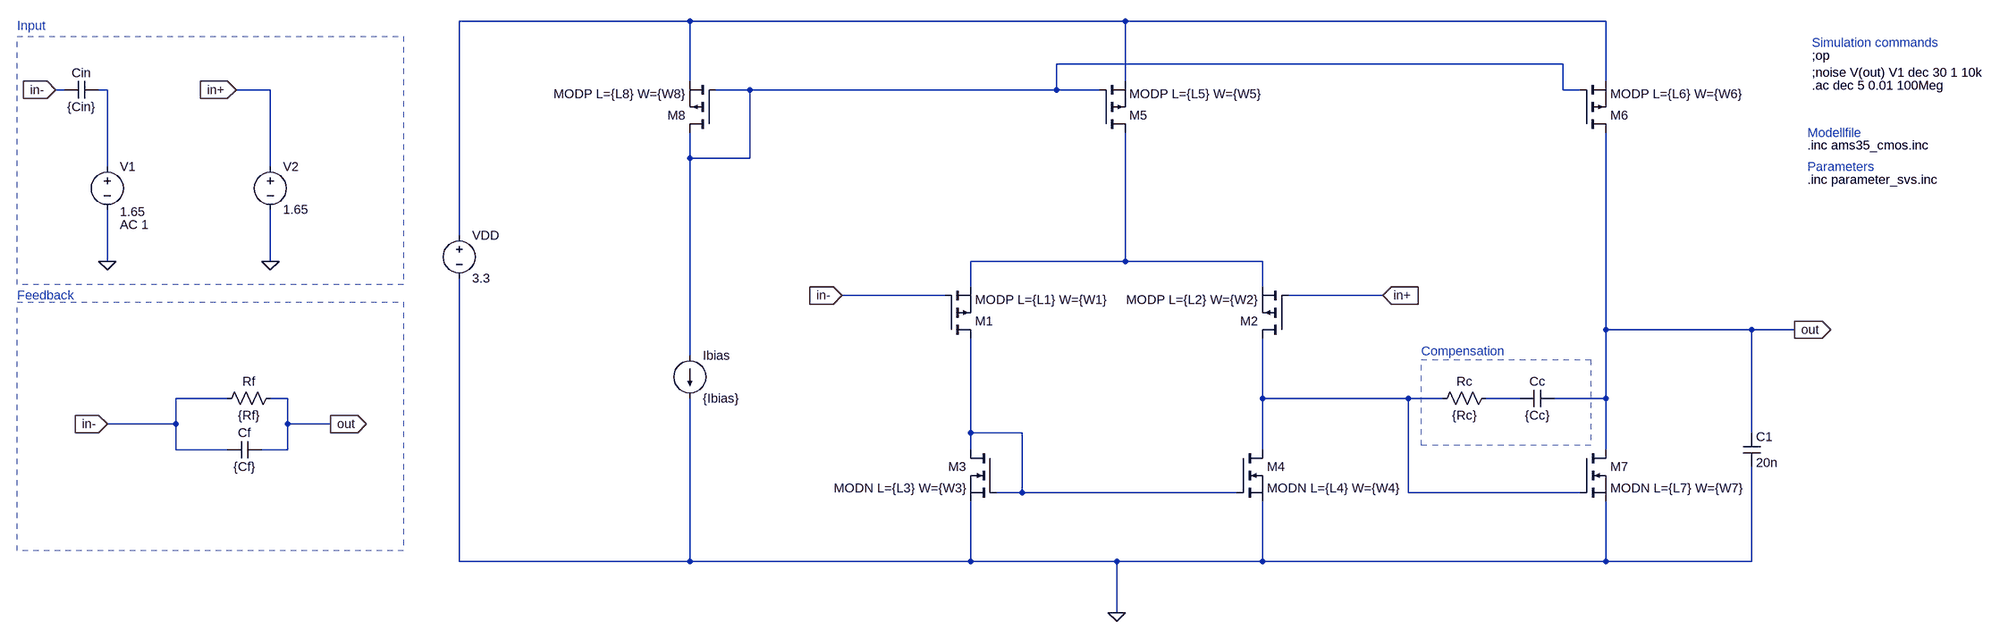
[diagram p0: schematic miller_ota_svs.asc]
miller_ota_svs.asc, the LTspice schematic file:
Version 4
SHEET 1 4076 2488
WIRE 1296 816 816 816
WIRE 2176 816 1296 816
WIRE 3072 816 2176 816
WIRE 2992 896 2048 896
WIRE 1296 928 1296 816
WIRE 2176 928 2176 816
WIRE 3072 928 3072 816
WIRE 80 944 64 944
WIRE 160 944 144 944
WIRE 464 944 400 944
WIRE 1408 944 1344 944
WIRE 2048 944 2048 896
WIRE 2048 944 1408 944
WIRE 2128 944 2048 944
WIRE 2992 944 2992 896
WIRE 3024 944 2992 944
WIRE 1296 1072 1296 1024
WIRE 1408 1072 1408 944
WIRE 1408 1072 1296 1072
WIRE 160 1088 160 944
WIRE 464 1088 464 944
WIRE 816 1216 816 816
WIRE 160 1264 160 1168
WIRE 464 1264 464 1168
WIRE 2176 1264 2176 1024
WIRE 2176 1264 1888 1264
WIRE 2432 1264 2176 1264
WIRE 1888 1312 1888 1264
WIRE 2432 1312 2432 1264
WIRE 1840 1328 1648 1328
WIRE 2656 1328 2480 1328
WIRE 3072 1392 3072 1024
WIRE 3344 1392 3072 1392
WIRE 3424 1392 3344 1392
WIRE 1296 1440 1296 1072
WIRE 384 1520 288 1520
WIRE 496 1520 464 1520
WIRE 2432 1520 2432 1408
WIRE 2704 1520 2432 1520
WIRE 2768 1520 2704 1520
WIRE 2912 1520 2848 1520
WIRE 3072 1520 3072 1392
WIRE 3072 1520 2976 1520
WIRE 288 1568 288 1520
WIRE 288 1568 160 1568
WIRE 496 1568 496 1520
WIRE 576 1568 496 1568
WIRE 1888 1584 1888 1408
WIRE 1984 1584 1888 1584
WIRE 3344 1584 3344 1392
WIRE 288 1616 288 1568
WIRE 384 1616 288 1616
WIRE 496 1616 496 1568
WIRE 496 1616 448 1616
WIRE 1888 1616 1888 1584
WIRE 2432 1616 2432 1520
WIRE 3072 1616 3072 1520
WIRE 1984 1696 1984 1584
WIRE 1984 1696 1936 1696
WIRE 2384 1696 1984 1696
WIRE 2704 1696 2704 1520
WIRE 3024 1696 2704 1696
WIRE 816 1824 816 1296
WIRE 1296 1824 1296 1520
WIRE 1296 1824 816 1824
WIRE 1888 1824 1888 1712
WIRE 1888 1824 1296 1824
WIRE 2160 1824 1888 1824
WIRE 2432 1824 2432 1712
WIRE 2432 1824 2160 1824
WIRE 3072 1824 3072 1712
WIRE 3072 1824 2432 1824
WIRE 3344 1824 3344 1648
WIRE 3344 1824 3072 1824
WIRE 2160 1920 2160 1824
FLAG 3424 1392 out
IOPIN 3424 1392 Out
FLAG 2656 1328 in+
IOPIN 2656 1328 In
FLAG 1648 1328 in-
IOPIN 1648 1328 In
FLAG 2160 1920 0
FLAG 64 944 in-
IOPIN 64 944 In
FLAG 400 944 in+
IOPIN 400 944 In
FLAG 160 1264 0
FLAG 464 1264 0
FLAG 576 1568 out
IOPIN 576 1568 Out
FLAG 160 1568 in-
IOPIN 160 1568 In
SYMBOL pmos 1840 1408 M180
SYMATTR InstName M1
SYMATTR Value MODP L={L1} W={W1}
SYMBOL pmos 2480 1408 R180
SYMATTR InstName M2
SYMATTR Value MODP L={L2} W={W2}
SYMBOL pmos 2128 1024 M180
SYMATTR InstName M5
SYMATTR Value MODP L={L5} W={W5}
SYMBOL nmos 2384 1616 R0
SYMATTR InstName M4
SYMATTR Value MODN L={L4} W={W4}
SYMBOL nmos 1936 1616 M0
SYMATTR InstName M3
SYMATTR Value MODN L={L3} W={W3}
SYMBOL voltage 816 1200 R0
WINDOW 123 0 0 Left 2
WINDOW 39 0 0 Left 2
SYMATTR InstName VDD
SYMATTR Value 3.3
SYMBOL nmos 3024 1616 R0
SYMATTR InstName M7
SYMATTR Value MODN L={L7} W={W7}
SYMBOL pmos 3024 1024 M180
SYMATTR InstName M6
SYMATTR Value MODP L={L6} W={W6}
SYMBOL pmos 1344 1024 R180
SYMATTR InstName M8
SYMATTR Value MODP L={L8} W={W8}
SYMBOL current 1296 1440 R0
WINDOW 123 0 0 Left 2
WINDOW 39 0 0 Left 2
SYMATTR InstName Ibias
SYMATTR Value {Ibias}
SYMBOL cap 3328 1584 R0
SYMATTR InstName C1
SYMATTR Value 20n
SYMBOL cap 2976 1504 R90
WINDOW 0 0 32 VBottom 2
WINDOW 3 32 32 VTop 2
SYMATTR InstName Cc
SYMATTR Value {Cc}
SYMBOL res 480 1504 R90
WINDOW 0 0 56 VBottom 2
WINDOW 3 32 56 VTop 2
SYMATTR InstName Rf
SYMATTR Value {Rf}
SYMBOL cap 448 1600 R90
WINDOW 0 0 32 VBottom 2
WINDOW 3 32 32 VTop 2
SYMATTR InstName Cf
SYMATTR Value {Cf}
SYMBOL voltage 160 1072 R0
WINDOW 123 24 124 Left 2
WINDOW 39 0 0 Left 0
WINDOW 3 24 100 Left 2
SYMATTR Value2 AC 1
SYMATTR Value 1.65
SYMATTR InstName V1
SYMBOL voltage 464 1072 R0
WINDOW 123 0 0 Left 0
WINDOW 39 0 0 Left 0
SYMATTR InstName V2
SYMATTR Value 1.65
SYMBOL cap 144 928 R90
WINDOW 0 0 32 VBottom 2
WINDOW 3 32 32 VTop 2
SYMATTR InstName Cin
SYMATTR Value {Cin}
SYMBOL res 2864 1504 R90
WINDOW 0 0 56 VBottom 2
WINDOW 3 32 56 VTop 2
SYMATTR InstName Rc
SYMATTR Value {Rc}
TEXT 3448 1048 Left 2 !.inc ams35_cmos.inc
TEXT -8 824 Left 2 ;Input
TEXT -8 1328 Left 2 ;Feedback
TEXT 3456 856 Left 2 ;Simulation commands
TEXT 3456 880 Left 2 !;op
TEXT 3448 1088 Left 2 ;Parameters
TEXT 3448 1112 Left 2 !.inc parameter_svs.inc
TEXT 3448 1024 Left 2 ;Modellfile
TEXT 2728 1432 Left 2 ;Compensation
TEXT 3456 936 Left 2 !.ac dec 5 0.01 100Meg
TEXT 3456 912 Left 2 !;noise V(out) V1 dec 30 1 10k
RECTANGLE Normal -8 844 712 1308 2
RECTANGLE Normal -8 1340 712 1804 2
RECTANGLE Normal 2728 1448 3044 1608 2

The netlist it stands for:
* miller_ota_svs.asc
M1 N007 in- N004 N004 MODP L={L1} W={W1}
M2 N005 in+ N004 N004 MODP L={L2} W={W2}
M5 N004 N002 N001 N001 MODP L={L5} W={W5}
M4 N005 N007 0 0 MODN L={L4} W={W4}
M3 N007 N007 0 0 MODN L={L3} W={W3}
VDD N001 0 3.3
M7 out N005 0 0 MODN L={L7} W={W7}
M6 out N002 N001 N001 MODP L={L6} W={W6}
M8 N002 N002 N001 N001 MODP L={L8} W={W8}
Ibias N002 0 {Ibias}
C1 out 0 20n
Cc out N006 {Cc}
Rf out in- {Rf}
Cf out in- {Cf}
V1 N003 0 1.65 AC 1
V2 in+ 0 1.65
Cin N003 in- {Cin}
Rc N006 N005 {Rc}
.model NMOS NMOS
.model PMOS PMOS
.lib standard.mos
.inc ams35_cmos.inc
* Input
* Feedback
* Simulation commands
;op
* Parameters
.inc parameter_svs.inc
* Modellfile
* Compensation
.ac dec 5 0.01 100Meg
;noise V(out) V1 dec 30 1 10k
.backanno
.end